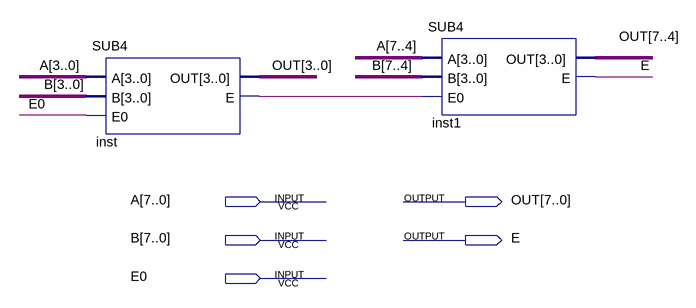
[diagram p0: schematic sheet]
// Quartus schematic SUB8.bdf as structural Verilog: 2 symbols, 5 pins
module SUB8 (
  input  [7:0] A,
  input  [7:0] B,
  input  E0,
  output [7:0] OUT,
  output E
);

  wire inst_e;

  SUB4 inst (.A(A[3:0]), .B(B[3:0]), .E0(E0), .OUT(OUT[3:0]), .E(inst_e));
  SUB4 inst1 (.A(A[7:4]), .B(B[7:4]), .E0(inst_e), .OUT(OUT[7:4]), .E(E));
endmodule
